# Altium schematic sheet CHANGE_FMU3_REV_G.SchDoc: Pixhawk_mini_8L.sch
size A4; Date: 18/08/2014 1:53:31 PM; DrawnBy: Philip Rowse; SheetNumber: 10; SheetTotal: 10
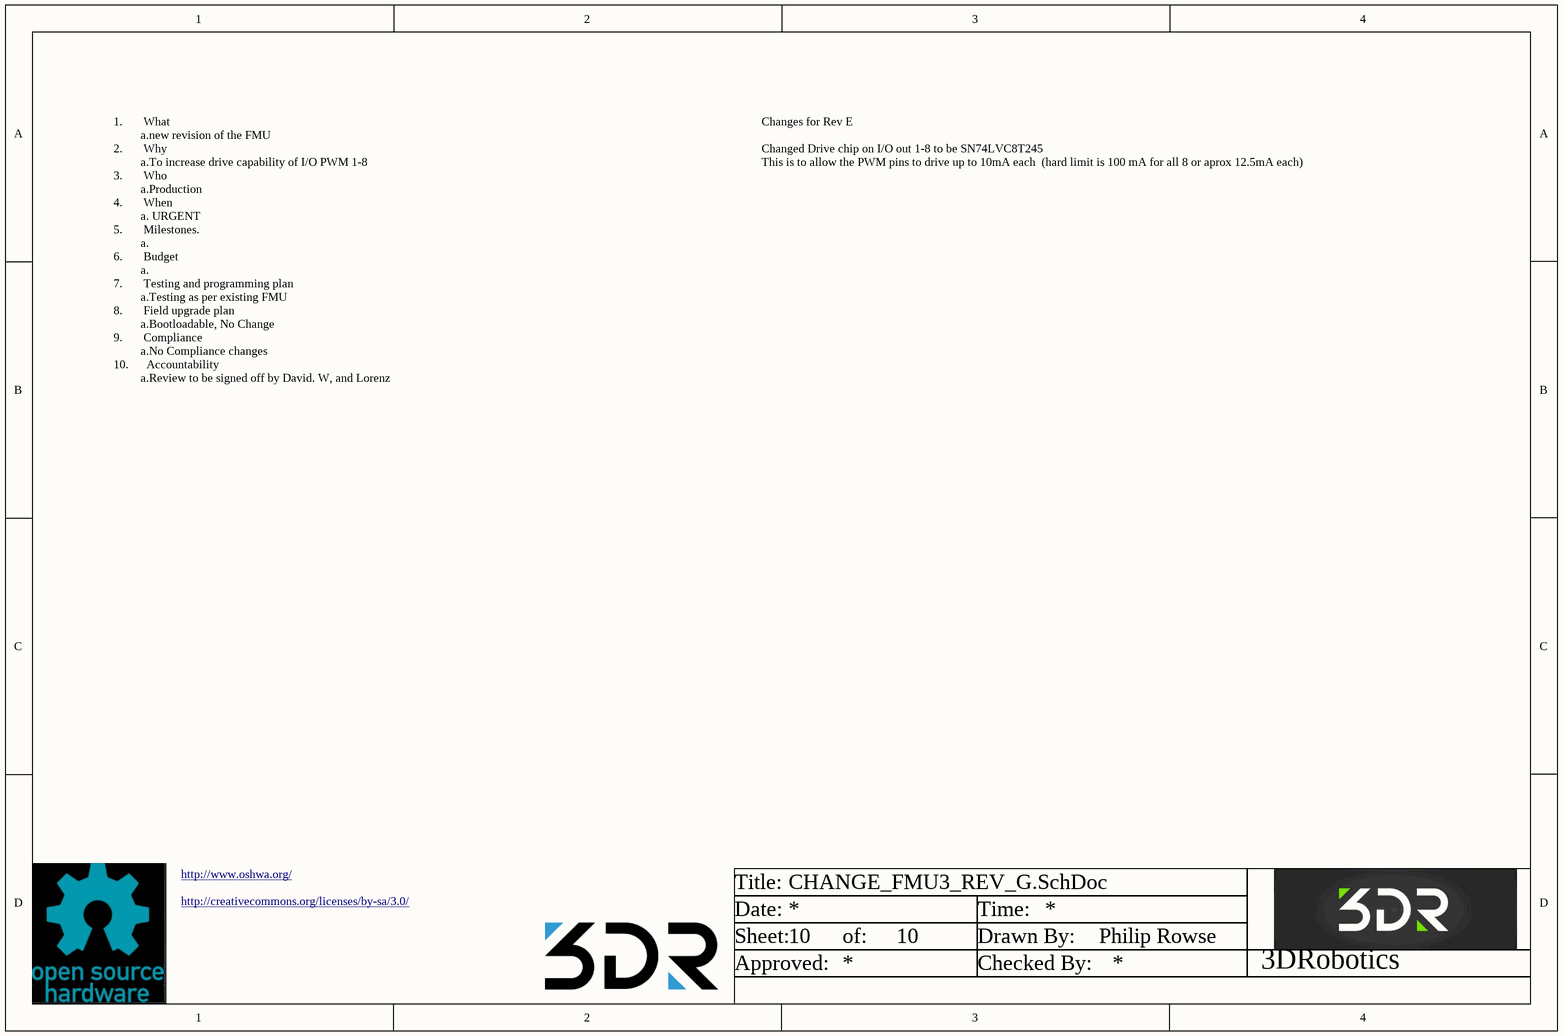
[diagram p0: CHANGE_FMU3_REV_G.SchDoc]

## Parts
3DR_Logo  DO NOT PLACE  [3DR_AU]  (value not drawn)

## Notes on the sheet
- Changes for Rev E
  Changed Drive chip on I/O out 1-8 to be SN74LVC8T245
  This is to allow the PWM pins to drive up to 10mA each  (hard limit is 100 mA for all 8 or aprox 12.5mA each)
- 1.       What
  a.new revision of the FMU
  2.       Why
  a.To increase drive capability of I/O PWM 1-8
  3.       Who
  a.Production
  4.       When
  a. URGENT
  5.       Milestones.
  a.
  6.       Budget
  a.
  7.       Testing and programming plan
  a.Testing as per existing FMU
  8.       Field upgrade plan
  a.Bootloadable, No Change
  9.       Compliance
  a.No Compliance changes
  10.      Accountability
  a.Review to be signed off by David. W, and Lorenz
- http://www.oshwa.org/
- http://creativecommons.org/licenses/by-sa/3.0/
- Title:
- Date:
- Time:
- Sheet:
- Approved:
- of:
- Drawn By:
- Checked By:
- 3DRobotics

## Library data of the parts
3DR_Logo = 3DR_LOGO